# Altium schematic sheet Source.SchDoc
size A4
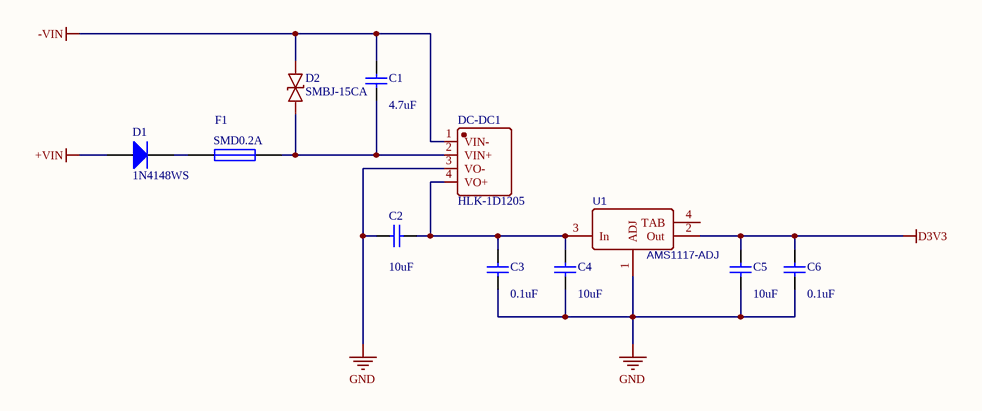
[diagram p0: Source.SchDoc]

## Parts
C1  value 4.7uF  [C1206]
C2  value 10uF  [C1206]
C3  value 0.1uF  [C1206]
C4  value 10uF  [C1206]
C5  value 10uF  [C1206]
C6  value 0.1uF  [C1206]
D1  1N4148WS  [SOD-323]
D2  SMBJ-15CA  [SMB_L4.6-W3.6-LS5.3-BI]
DC-DC1  HLK-1D1205  [PWRM-TH_HLK-1DXXXX]
SMD0.2A  F1  [C1206]
U1  AMS1117-ADJ  [SOT-223_L6.7-W3.5-P2.30-BR]

## Nets
+VIN: D1.1(A)
-VIN: C1.2 D2.2 DC-DC1.1(VIN-)
D3V3: C5.2 C6.2 U1.2(Out)
GND: C2.1 C3.2 C4.1 C5.1 C6.1 DC-DC1.3(VO-) U1.1(ADJ)
NetC1_1: C1.1 D2.1 DC-DC1.2(VIN+) SMD0.2A.2
NetC2_2: C2.2 C3.1 C4.2 DC-DC1.4(VO+) U1.3(In)
NetD1_2: D1.2(K) SMD0.2A.1

Not connected (* = marked no-connect by the designer): U1 4(TAB)

## Library data of the parts
C1-C6 = Cap Semi: Capacitor (Semiconductor SIM Model); Published: 8-Jun-2000; LatestRevisionDate: 29-May-2009; LatestRevisionNote: IPC-7351 Footprint Added.; PackageReference: C1206; Publisher: Altium Limited; PackageDescription: Chip Capacitor
D1 = 1N4148WS_SOD-323: 二极管; ComponentLink1Description: 供应商链接; ComponentLink1URL: http://www.szlcsc.com/product/details_2485.html; Package: SOD-323; Supplier: LC; SuppliersPartNumber: C2128
D2 = SMBJ-XXCA
DC-DC1 = HLK-1D12XX
SMD0.2A = Fuse 1: Fuse; Published: 8-Jun-2000; LatestRevisionDate: 17-Jul-2002; LatestRevisionNote: Re-released for DXP Platform.; PackageReference: PIN-W2/E2.8; Publisher: Altium Limited; PackageDescription: Thru-Hole; 2 Leads
U1 = AMS1117-ADJ: BOM_Manufacturer: AMS; sourceId: 0btnFXRxP; Contributor: GerryChen; SMT Type: Extend; BOM_Supplier: LCSC; BOM_Manufacturer Part: AMS1117-ADJ; image: //image.lceda.cn/szlcsc/C6188.jpg; BOM_Supplier Part: C6188; BOM_JLCPCB SMD: Yes; spicePre: U; spiceSymbolName: AMS1117-ADJ